# Altium project CAN_Analyzer.PrjPcb
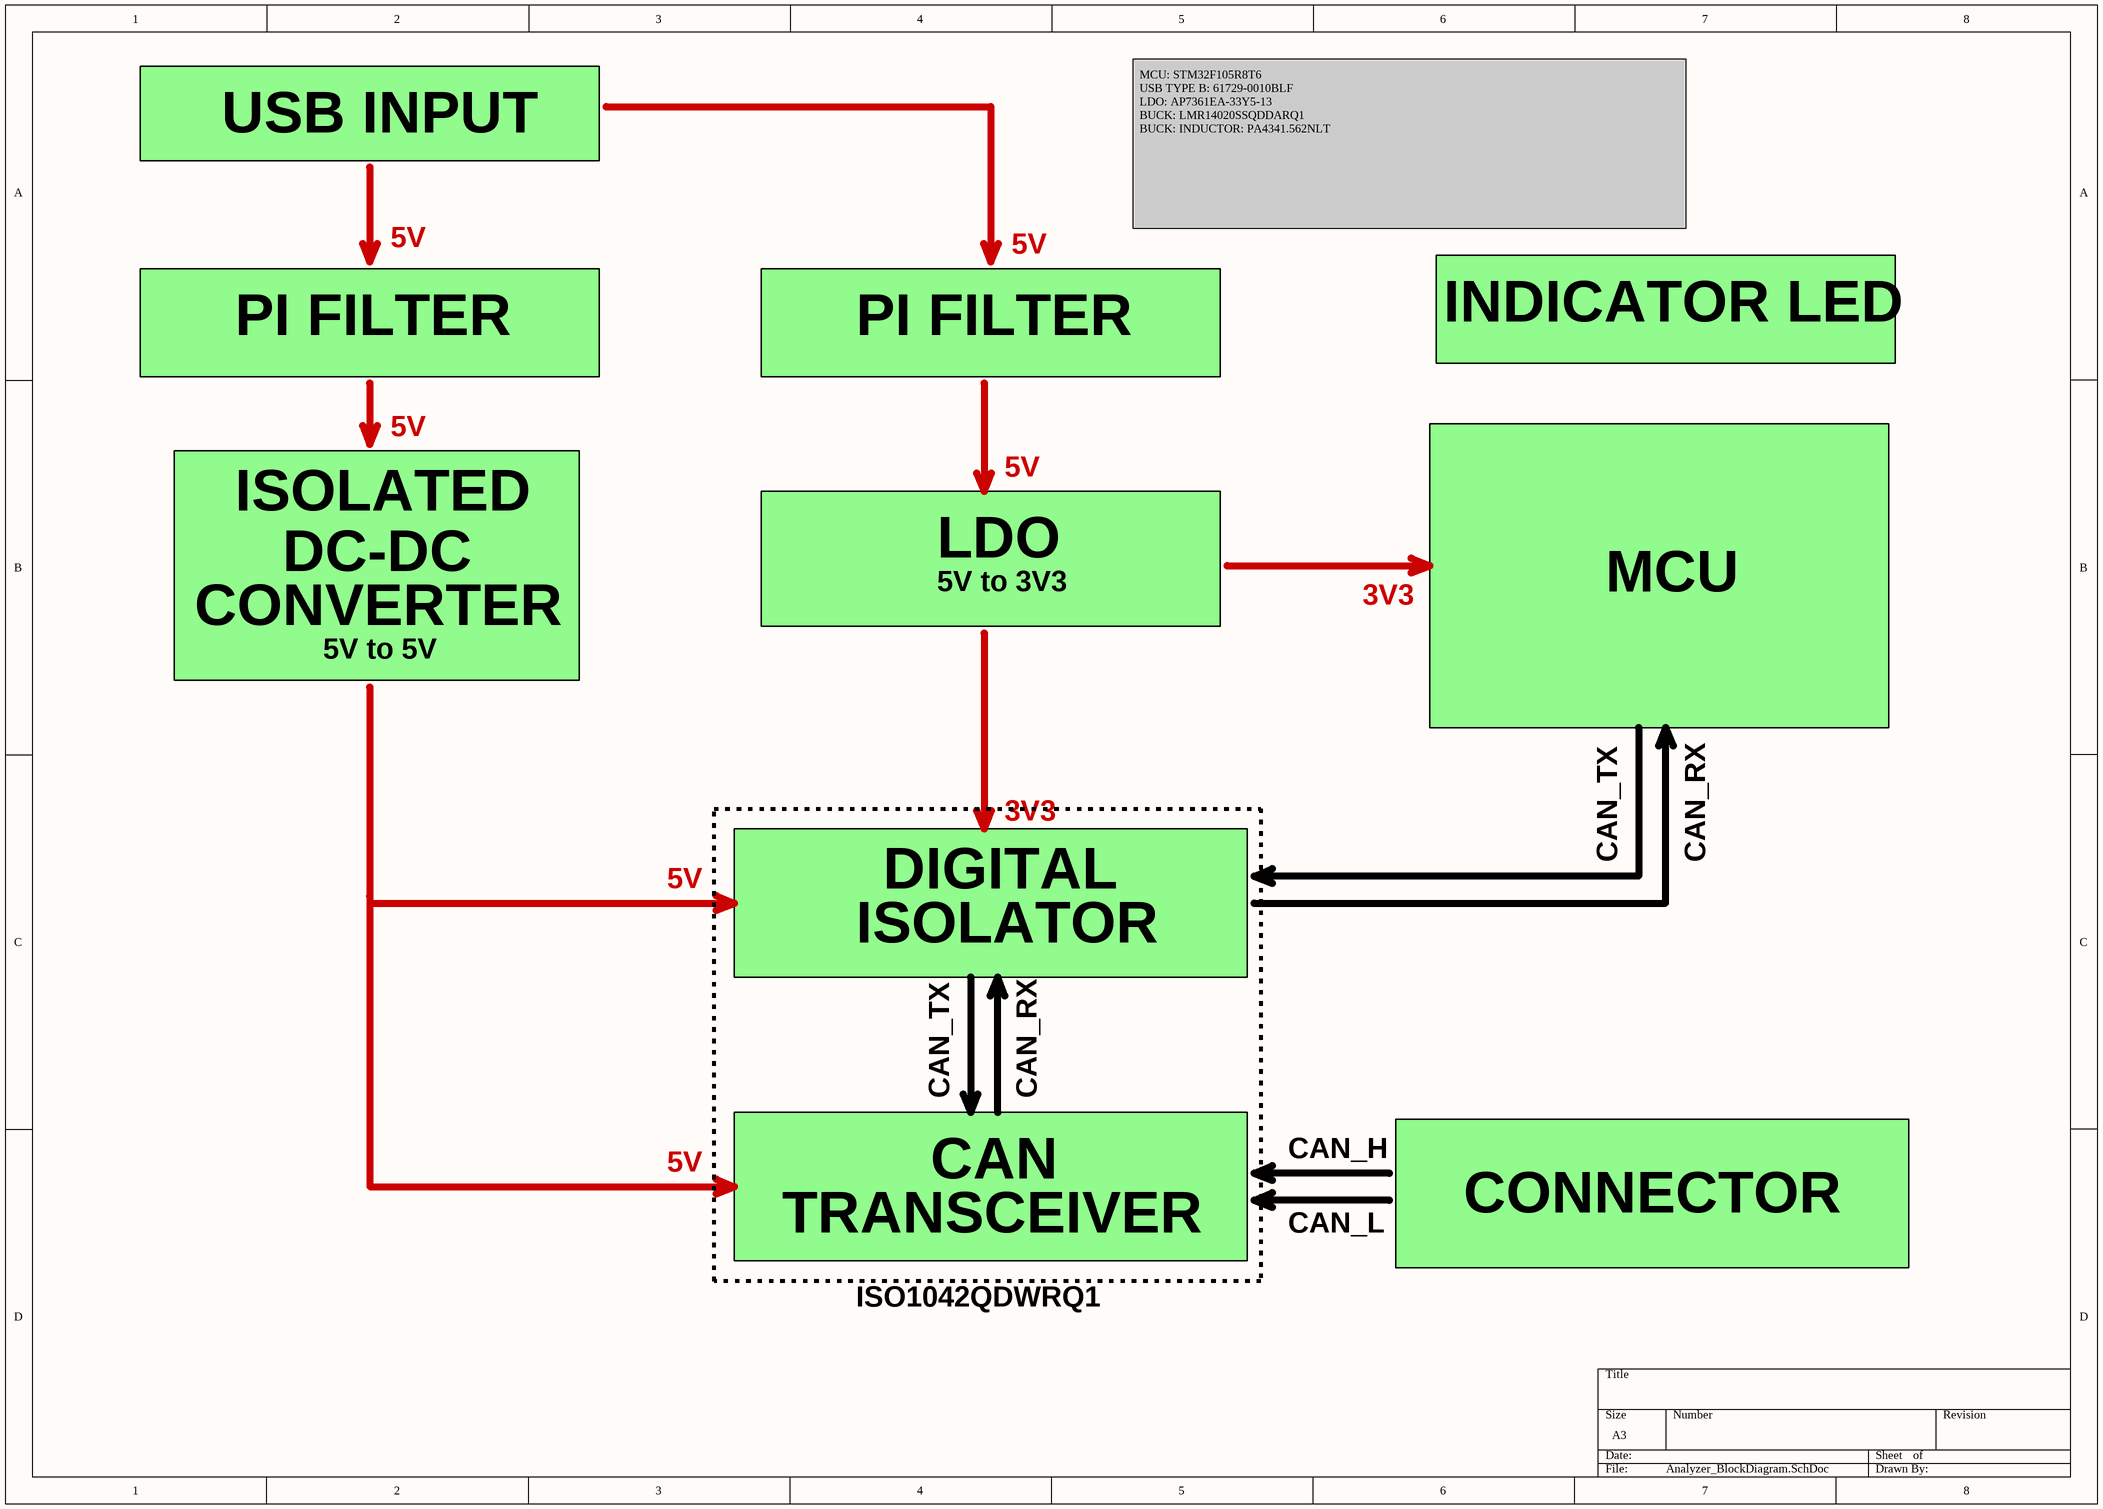
[diagram p0: Analyzer_BlockDiagram.SchDoc]
3 sheets, 78 parts. Net scope: global (net labels, ports and power ports of the same name join across sheets).
Sheets:
  Analyzer_BlockDiagram.SchDoc
  Analyzer_MCUSchematic.SchDoc
  Analyzer_PowerSchematic.SchDoc

## Sheet Analyzer_BlockDiagram.SchDoc
size A3; SheetNumber: 1; SheetTotal: 2

### Notes on the sheet
- USB INPUT
- MCU: STM32F105R8T6
  USB TYPE B: 61729-0010BLF
  LDO: AP7361EA-33Y5-13
  BUCK: LMR14020SSQDDARQ1
  BUCK: INDUCTOR: PA4341.562NLT
- 5V
- PI FILTER
- INDICATOR LED
- ISOLATED
- DC-DC
- LDO
- CONVERTER
- 5V to 3V3
- 3V3
- MCU
- 5V to 5V
- CAN_TX
- CAN_RX
- DIGITAL
- ISOLATOR
- CAN
- CAN_H
- TRANSCEIVER
- CAN_L
- CONNECTOR
- ISO1042QDWRQ1

## Sheet Analyzer_MCUSchematic.SchDoc
size A3; SheetNumber: 2; SheetTotal: 3
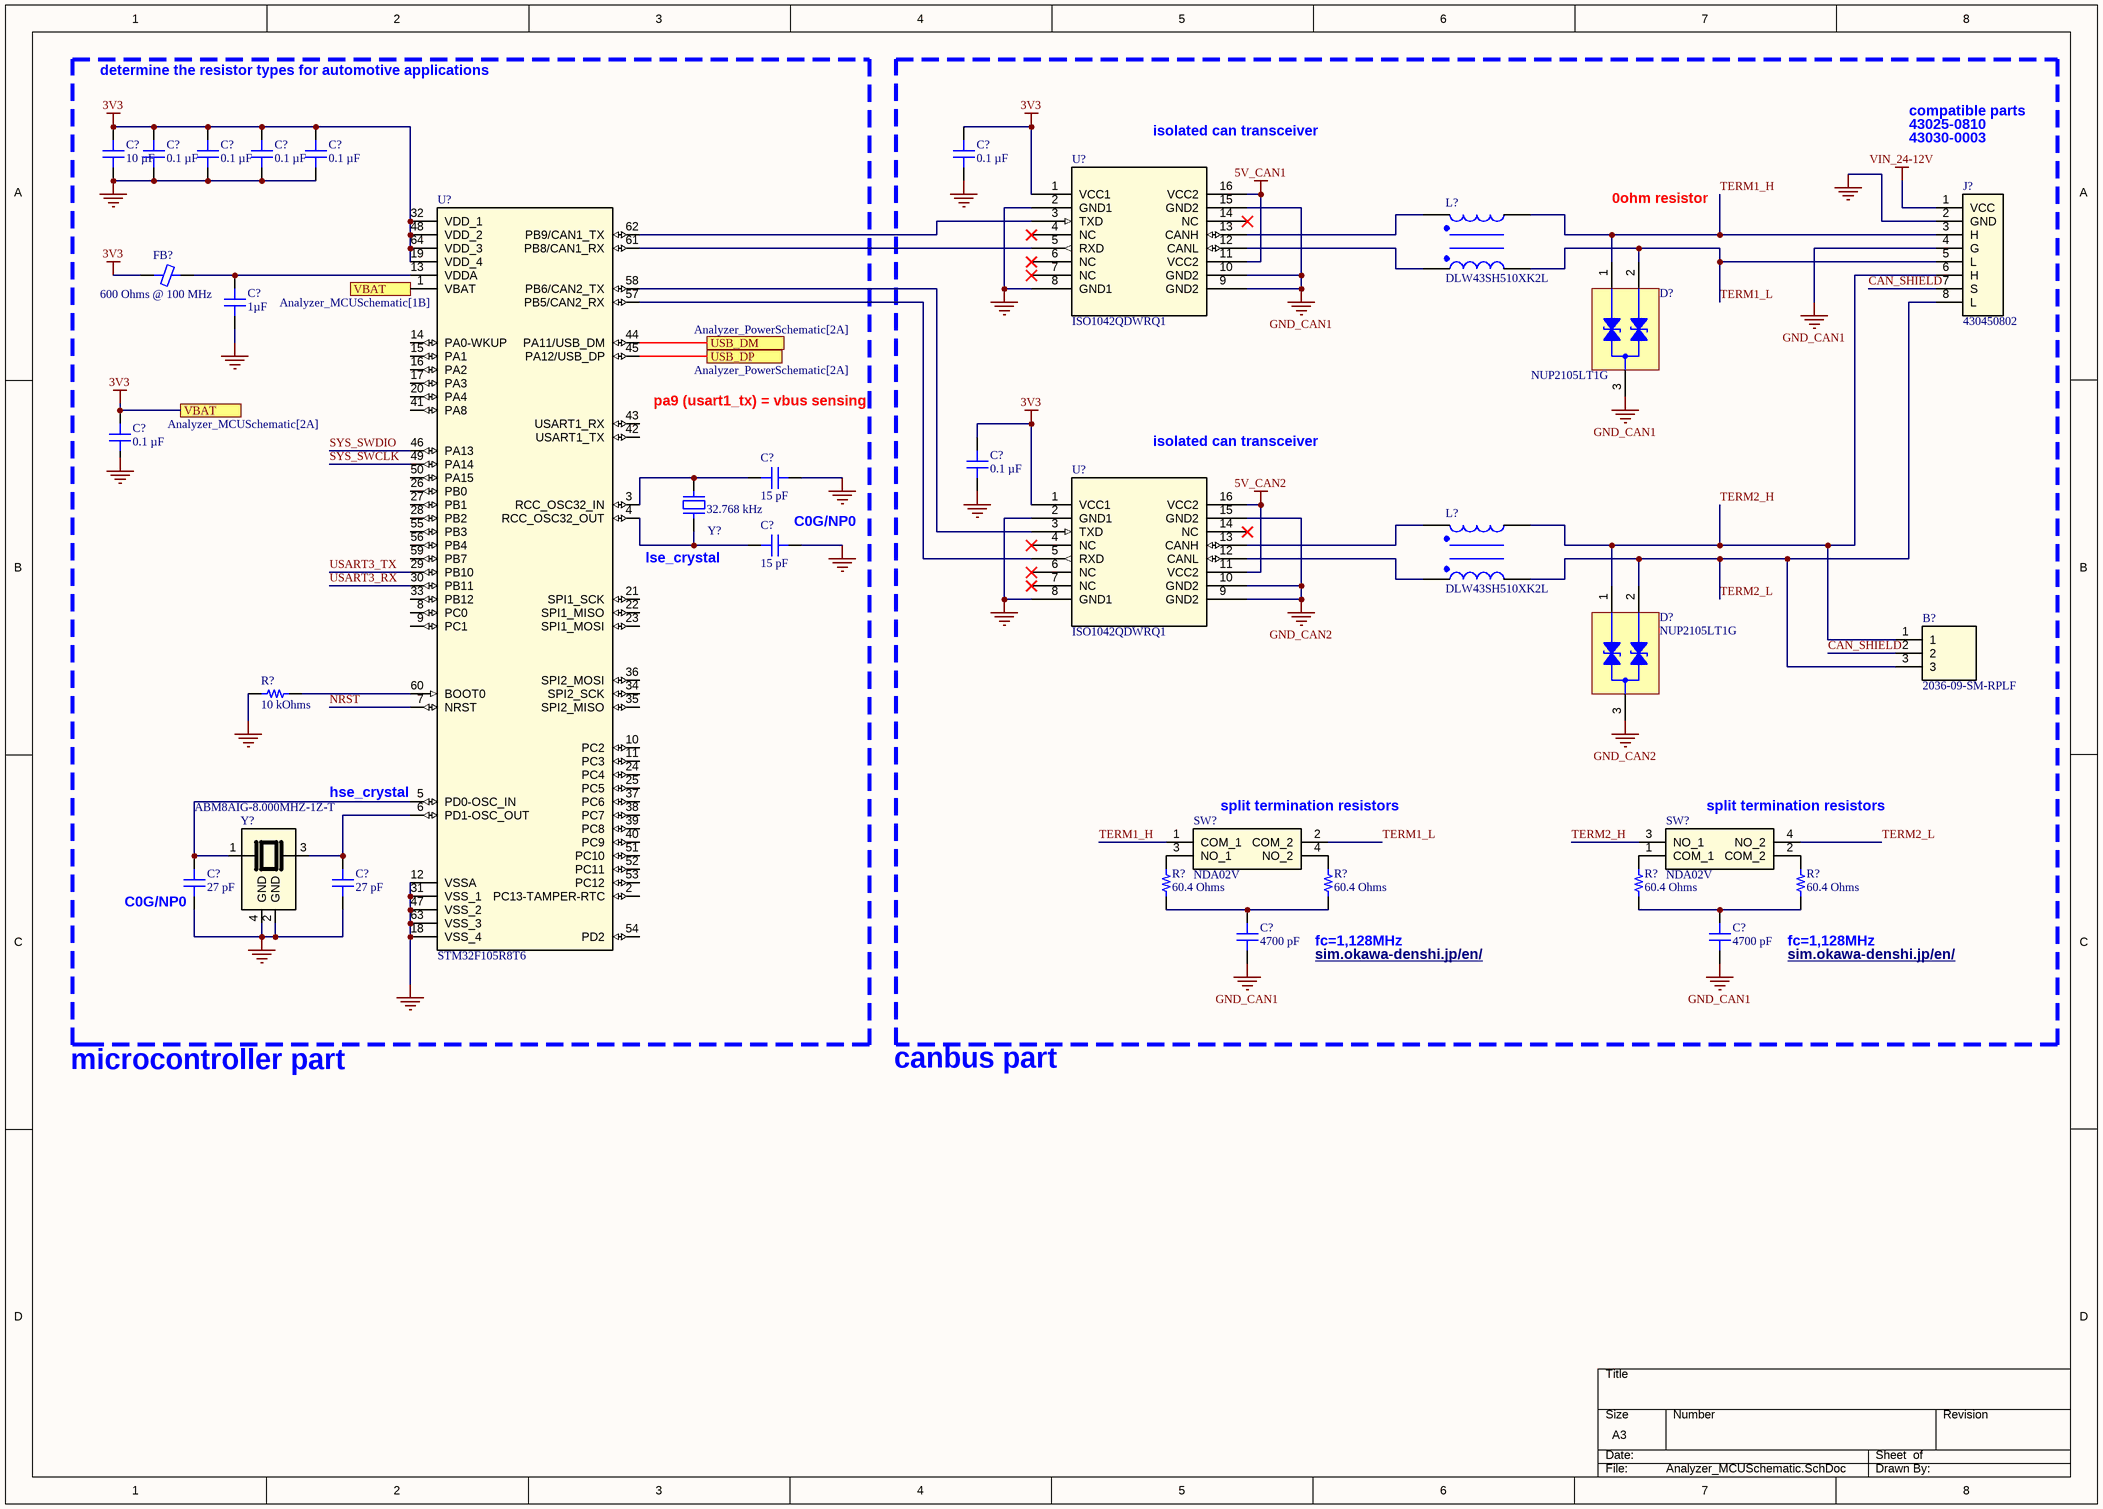
[diagram p1: Analyzer_MCUSchematic.SchDoc]

### Parts
(Parts that share a designator on the sheet are numbered #1, #2 ... from top to bottom, then left to right.)
B?  2036-09-SM-RPLF  [203609SMRPLF]
C?#1  10 µF  [CAP 0805_2012]
C?#2  0.1 µF  [CAP 0603_1608]
C?#3  0.1 µF  [CAP 0603_1608]
C?#4  0.1 µF  [CAP 0603_1608]
C?#5  0.1 µF  [CAP 0603_1608]
C?#6  0.1 µF  [CAP 0603_1608]
C?#7  1µF  [CAP 0603_1608]
C?#8  0.1 µF  [CAP 0603_1608]
C?#9  0.1 µF  [CAP 0603_1608]
C?#10  15 pF  [CAP 0603_1608]
C?#11  15 pF  [CAP 0603_1608]
C?#12  27 pF  [CAP 0603_1608]
C?#13  27 pF  [CAP 0603_1608]
C?#14  4700 pF  [CAP 0603_1608]
C?#15  4700 pF  [CAP 0603_1608]
D?#1  NUP2105LT1G  [ON SEMI SOT-23-3]
D?#2  NUP2105LT1G  [ON SEMI SOT-23-3]
FB?#1  600 Ohms @ 100 MHz  [FER 0603_1608]
J?#1  430450802  [CONN_SD-43045-001_08_MOL]
L?#1  DLW43SH510XK2L  [FIL_DLW43SH510XK2L]
L?#2  DLW43SH510XK2L  [FIL_DLW43SH510XK2L]
R?#1  10 kOhms  [RES 0603_1608]
R?#2  60.4 Ohms  [RES 0603_1608]
R?#3  60.4 Ohms  [RES 0603_1608]
R?#4  60.4 Ohms  [RES 0603_1608]
R?#5  60.4 Ohms  [RES 0603_1608]
SW?#1  NDA02V  [NDA02V]
SW?#2  NDA02V  [NDA02V]
U?#1  ISO1042QDWRQ1  [DW16_TEX]
U?#2  STM32F105R8T6  [QFP50P1200X1200X160-64N]
U?#3  ISO1042QDWRQ1  [DW16_TEX]
Y?#1  32.768 kHz  [ABRACON ABS06]
Y?#2  ABM8AIG-8.000MHZ-1Z-T  [XTAL_ABM8AIG-8.000MHZ-1Z-T]

### Ports
USB_DM (see Analyzer_PowerSchematic[2A]), USB_DP (see Analyzer_PowerSchematic[2A]), VBAT (see Analyzer_MCUSchematic[1B]), VBAT (see Analyzer_MCUSchematic[2A])

### Nets
3V3: C?#1.2 C?#2.2 C?#3.2 C?#4.2 C?#5.2 C?#6.2 C?#8.2 C?#9.2 FB?#1.1 U?#1.1(VCC1) U?#2.1(VBAT) U?#2.19(VDD_4) U?#2.32(VDD_1) U?#2.48(VDD_2) U?#2.64(VDD_3) U?#3.1(VCC1) ; port VBAT
5V_CAN1: U?#1.11(VCC2) U?#1.16(VCC2)
5V_CAN2: U?#3.11(VCC2) U?#3.16(VCC2)
GND: C?#1.1 C?#2.1 C?#3.1 C?#4.1 C?#5.1 C?#6.1 C?#7.1 C?#9.1 C?#10.2 C?#11.2 C?#12.1 C?#13.1 J?#1.2(GND) R?#1.1 U?#1.2(GND1) U?#1.8(GND1) U?#2.12(VSSA) U?#2.18(VSS_4) U?#2.31(VSS_1) U?#2.47(VSS_2) U?#2.63(VSS_3) U?#3.2(GND1) U?#3.8(GND1) Y?#2.2(GND) Y?#2.4(GND)
GND_CAN1: C?#14.1 C?#15.1 D?#1.3(I/O_2) J?#1.4(G) U?#1.9(GND2) U?#1.10(GND2) U?#1.15(GND2)
GND_CAN2: D?#2.3(I/O_2) U?#3.9(GND2) U?#3.10(GND2) U?#3.15(GND2)
VIN_24-12V: J?#1.1(VCC)
CAN_SHIELD: B?.2 J?#1.7(S)
NRST: U?#2.7(NRST)
SYS_SWCLK: U?#2.49(PA14)
SYS_SWDIO: U?#2.46(PA13)
TERM1_H: D?#1.1(I/O_1) J?#1.3(H) L?#1.2 SW?#2.1(COM_1)
TERM1_L: D?#1.2(GND) J?#1.5(L) L?#1.3 SW?#2.2(COM_2)
TERM2_H: B?.1 D?#2.1(I/O_1) J?#1.6(H) L?#2.2 SW?#1.3(NO_1)
TERM2_L: B?.3 D?#2.2(GND) J?#1.8(L) L?#2.3 SW?#1.4(NO_2)
USART3_RX: U?#2.30(PB11)
USART3_TX: U?#2.29(PB10)
NetC?#7_2: C?#7.2 FB?#1.2 U?#2.13(VDDA)
NetC?#10_1: C?#10.1 U?#2.3(RCC_OSC32_IN) Y?#1.1
NetC?#11_1: C?#11.1 U?#2.4(RCC_OSC32_OUT) Y?#1.2
NetC?#12_2: C?#12.2 Y?#2.1
NetC?#13_2: C?#13.2 Y?#2.3
NetC?#14_2: C?#14.2 R?#2.2 R?#3.2
NetC?#15_2: C?#15.2 R?#4.2 R?#5.2
NetL?#1_1: L?#1.1 U?#1.13(CANH)
NetL?#1_4: L?#1.4 U?#1.12(CANL)
NetL?#2_1: L?#2.1 U?#3.13(CANH)
NetL?#2_4: L?#2.4 U?#3.12(CANL)
NetR?#1_2: R?#1.2 U?#2.60(BOOT0)
NetR?#2_1: R?#2.1 SW?#2.3(NO_1)
NetR?#3_1: R?#3.1 SW?#2.4(NO_2)
NetR?#4_1: R?#4.1 SW?#1.1(COM_1)
NetR?#5_1: R?#5.1 SW?#1.2(COM_2)
NetU?#1_3: U?#1.3(TXD) U?#2.62(PB9/CAN1_TX)
NetU?#1_5: U?#1.5(RXD) U?#2.61(PB8/CAN1_RX)
NetU?#2_44: U?#2.44(PA11/USB_DM) ; port USB_DM
NetU?#2_45: U?#2.45(PA12/USB_DP) ; port USB_DP
NetU?#2_57: U?#2.57(PB5/CAN2_RX) U?#3.5(RXD)
NetU?#2_58: U?#2.58(PB6/CAN2_TX) U?#3.3(TXD)

Not connected (* = marked no-connect by the designer): C?#8 1; U?#1 4(NC)* 6(NC)* 7(NC)* 14(NC)*; U?#2 2(PC13-TAMPER-RTC) 5(PD0-OSC_IN) 6(PD1-OSC_OUT) 8(PC0) 9(PC1) 10(PC2) 11(PC3) 14(PA0-WKUP) 15(PA1) 16(PA2) 17(PA3) 20(PA4) 21(SPI1_SCK) 22(SPI1_MISO) 23(SPI1_MOSI) 24(PC4) 25(PC5) 26(PB0) 27(PB1) 28(PB2) 33(PB12) 34(SPI2_SCK) 35(SPI2_MISO) 36(SPI2_MOSI) 37(PC6) 38(PC7) 39(PC8) 40(PC9) 41(PA8) 42(USART1_TX) 43(USART1_RX) 50(PA15) 51(PC10) 52(PC11) 53(PC12) 54(PD2) 55(PB3) 56(PB4) 59(PB7); U?#3 4(NC)* 6(NC)* 7(NC)* 14(NC)*

### Notes on the sheet
- determine the resistor types for automotive applications
- isolated can transceiver
- compatible parts
- 43025-0810
- 43030-0003
- 0ohm resistor
- (near U?#2) pa9 (usart1_tx) = vbus sensing
- lse_crystal
- (near C?#11) C0G/NP0
- (near U?#2) hse_crystal
- (near SW?#2) split termination resistors
- (near SW?#1) split termination resistors
- (near C?#12) C0G/NP0
- (near R?#3) fc=1,128MHz
- sim.okawa-denshi.jp/en/ <http://sim.okawa-denshi.jp/en/>
- (near R?#5) fc=1,128MHz
- microcontroller part
- canbus part
- Labels drawn without touching a wire or pin: GND

### Library data of the parts
B? = 2036-09-SM-RPLF: SURGE ARRESTOR GDT 90V SMT Bourns 2036 Series 90V 10 kA@ 10 Operation, 20 kA@ 1 Operation SMD 3 Electrode Gas Discharge Tube; Geometry.Height: 5.2mm; Manufacturer_Name: Bourns; Manufacturer_Part_Number: 2036-09-SM-RPLF; Mouser Part Number: 652-2036-09-SM-RPLF; Mouser Price/Stock: https://www.mouser.co.uk/ProductDetail/Bourns/2036-09-SM-RPLF?qs=lCOfWMjvbt%252BBO3tBZtiSUQ%3D%3D; Arrow Part Number: 2036-09-SM-RPLF; Arrow Price/Stock: https://www.arrow.com/en/products/2036-09-sm-rplf/bourns?utm_currency=USD&region=nac; Datasheet Link: https://www.bourns.com/PDFs/2036-xx-SM.pdf
C?#1 = C2012X7R1A106K125AE: CAP CER 10UF 10V X7R 0805; manufacturer: TDK Corporation; Tolerance: ±10%; Part Number: C2012X7R1A106K125AE; Capacitance: 10 µF; Applications: Boardflex Sensitive; componentlink1description: Datasheet; componentlink1url: https://product.tdk.com/info/en/catalog/datasheets/mlcc_commercial_soft_en.pdf?ref_disty=digikey; componentlink2description: DigiKey Link; componentlink2url: https://www.digikey.com/en/products/detail/tdk-corporation/C2012X7R1A106K125AE/5809181; Device Package: 0805 (2012 Metric); Features: Soft Termination; lastupdated: 6.04.2026 19:33:17; Lifecycle Status: Active; Minimum Order: 1; Mounting Type: Surface Mount, MLCC; Operating Temperature: -55°C ~ 125°C; Package / Case: 0805 (2012 Metric); packaging: TapeAndReel; partid: 3036; Part Status: Active; price: 0.08; series: C; Size / Dimension: 0.079" L x 0.049" W (2.00mm x 1.25mm); Supplier 1: DigiKey; Supplier Part Number 1: 445-173616-1-ND; Temperature Coefficient: X7R; Thickness (Max): 0.059" (1.50mm); value: 10 µF; Voltage - Rated: 10V
C?#2-C?#6 C?#8 C?#9 = 0603B104J160CT: CAP CER 0.1UF 16V X7R 0603; manufacturer: Walsin Technology Corporation; Tolerance: ±5%; Part Number: 0603B104J160CT; Capacitance: 0.1 µF; Applications: General Purpose; componentlink1description: Datasheet; componentlink1url: http://www.passivecomponent.com/wp-content/uploads/2018/10/MLCC.pdf; componentlink2description: DigiKey Link; componentlink2url: https://www.digikey.com/en/products/detail/walsin-technology-corporation/0603B104J160CT/9354886; Device Package: 0603 (1608 Metric); lastupdated: 6.04.2026 19:23:13; Lifecycle Status: Active; Minimum Order: 1; Mounting Type: Surface Mount, MLCC; Operating Temperature: -55°C ~ 125°C; Package / Case: 0603 (1608 Metric); packaging: TapeAndReel; partid: 13150; Part Status: Active; price: 0.01; series: -; Size / Dimension: 0.063" L x 0.031" W (1.60mm x 0.80mm); Supplier 1: DigiKey; Supplier Part Number 1: 1292-1389-1-ND; Temperature Coefficient: X7R; Thickness (Max): 0.034" (0.87mm); value: 0.1 µF; Voltage - Rated: 16V
C?#7 = 0603YC105KAT2A: CAP CER 1UF 16V X7R 0603; manufacturer: AVX Corporation; Tolerance: ±10%; Part Number: 0603YC105KAT2A; Capacitance: 1µF; Applications: General Purpose; componentlink1description: Datasheet; componentlink1url: http://datasheets.avx.com/X7RDielectric.pdf; componentlink2description: DigiKey Link; componentlink2url: http://digikey.com/product-detail/en/avx-corporation/0603YC105KAT2A/478-5010-1-ND/1888221; Device Package: 0603 (1608 Metric); lastupdated: 2.09.2020 01:03:14; Lifecycle Status: Active; Minimum Order: 1; Mounting Type: Surface Mount, MLCC; Operating Temperature: -55°C ~ 125°C; Package / Case: 0603 (1608 Metric); packaging: TapeAndReel; partid: 14128; Part Status: Active; price: 0.04; series: -; Size / Dimension: 0.063" L x 0.032" W (1.60mm x 0.81mm); Supplier 1: DigiKey; Supplier Part Number 1: 478-5010-1-ND; Temperature Coefficient: X7R; Thickness (Max): 0.035" (0.90mm); value: 1µF; Voltage - Rated: 16V
C?#10 C?#11 = C0603C150J5GACAUTO: CAP CER 15PF 50V C0G/NP0 0603; manufacturer: KEMET; Temperature Coefficient: C0G, NP0; Tolerance: ±5%; Part Number: C0603C150J5GACAUTO; Capacitance: 15 pF; Applications: Automotive; componentlink1description: Datasheet; componentlink1url: https://api.kemet.com/component-edge/download/datasheet/C0603C150J5GACAUTO.pdf; componentlink2description: DigiKey Link; componentlink2url: https://www.digikey.com/en/products/detail/kemet/C0603C150J5GACAUTO/3314856; Device Package: 0603 (1608 Metric); Features: Low ESL; lastupdated: 6.04.2026 19:23:31; Lifecycle Status: Active; Minimum Order: 1; Mounting Type: Surface Mount, MLCC; Operating Temperature: -55°C ~ 125°C; Package / Case: 0603 (1608 Metric); packaging: TapeAndReel; partid: 7972; Part Status: Active; price: 0.01; Ratings: AEC-Q200; series: SMD Auto C0G; Size / Dimension: 0.063" L x 0.031" W (1.60mm x 0.80mm); Supplier 1: DigiKey; Supplier Part Number 1: 399-6859-1-ND; Thickness (Max): 0.034" (0.87mm); value: 15 pF; Voltage - Rated: 50V
C?#12 C?#13 = C0603C270J5GACAUTO: CAP CER 27PF 50V C0G/NP0 0603; manufacturer: KEMET; Temperature Coefficient: C0G, NP0; Tolerance: ±5%; Part Number: C0603C270J5GACAUTO; Capacitance: 27 pF; Applications: Automotive; componentlink1description: Datasheet; componentlink1url: https://api.kemet.com/component-edge/download/datasheet/C0603C270J5GACAUTO.pdf; componentlink2description: DigiKey Link; componentlink2url: https://www.digikey.com/en/products/detail/kemet/C0603C270J5GACAUTO/7516234; Device Package: 0603 (1608 Metric); Features: Low ESL; lastupdated: 6.04.2026 19:23:16; Lifecycle Status: Active; Minimum Order: 1; Mounting Type: Surface Mount, MLCC; Operating Temperature: -55°C ~ 125°C; Package / Case: 0603 (1608 Metric); packaging: TapeAndReel; partid: 12459; Part Status: Active; price: 0.01; Ratings: AEC-Q200; series: SMD Auto C0G; Size / Dimension: 0.063" L x 0.031" W (1.60mm x 0.80mm); Supplier 1: DigiKey; Supplier Part Number 1: 399-16001-1-ND; Thickness (Max): 0.034" (0.87mm); value: 27 pF; Voltage - Rated: 50V
C?#14 C?#15 = C1608NP01H472J080AA: CAP CER 4700PF 50V NP0 0603; manufacturer: TDK Corporation; Temperature Coefficient: C0G, NP0; Tolerance: ±5%; Part Number: C1608NP01H472J080AA; Capacitance: 4700 pF; Applications: General Purpose; componentlink1description: Datasheet; componentlink1url: https://product.tdk.com/info/en/catalog/datasheets/mlcc_commercial_hightemp_en.pdf?ref_disty=digikey; componentlink2description: DigiKey Link; componentlink2url: https://www.digikey.com/en/products/detail/tdk-corporation/C1608NP01H472J080AA/3951319; Device Package: 0603 (1608 Metric); Features: High Temperature; lastupdated: 6.04.2026 19:23:27; Lifecycle Status: Active; Minimum Order: 1; Mounting Type: Surface Mount, MLCC; Operating Temperature: -55°C ~ 150°C; Package / Case: 0603 (1608 Metric); packaging: TapeAndReel; partid: 9062; Part Status: Active; price: 0.04; series: C; Size / Dimension: 0.063" L x 0.031" W (1.60mm x 0.80mm); Supplier 1: DigiKey; Supplier Part Number 1: 445-14083-1-ND; Thickness (Max): 0.035" (0.90mm); value: 4700 pF; Voltage - Rated: 50V
D?#1 D?#2 = NUP2105LT1G: TVS DIODE 24V 44V SOT23-3; Manufacturer: ON Semiconductor; Bidirectional Channels: 2; Capacitance @ Frequency: 30pF @ 1MHz; Current - Peak Pulse (10/1000µs): 8A (8/20µs); Power Line Protection: No; Power - Peak Pulse: 350W; Type: Zener; Voltage - Breakdown (Min): 26.2V; Voltage - Reverse Standoff (Typ): 24V (Min); Part Number: NUP2105LT1G; Applications: General Purpose; ComponentLink1Description: Datasheet; ComponentLink1URL: http://www.onsemi.com/pub/Collateral/NUP2105L-D.PDF; ComponentLink2Description: DigiKey Link; ComponentLink2URL: http://digikey.com/product-detail/en/on-semiconductor/NUP2105LT1G/NUP2105LT1GOSCT-ND/1485001; Device Package: TO-236-3, SC-59, SOT-23-3; LastUpdated: 30.03.2020 16:33:57; Lifecycle Status: Active; Minimum Order: 1; Mounting Type: Surface Mount; Operating Temperature: -55°C ~ 150°C (TJ); Package / Case: TO-236-3, SC-59, SOT-23-3; Packaging: TapeAndReel; PartId: 10506; Part Status: Active; Price: 0.09; Series: -; Supplier 1: DigiKey; Supplier Part Number 1: NUP2105LT1GOSCT-ND; Supplier Device Package: SOT-23-3 (TO-236); Voltage - Clamping (Max) @ Ipp: 44V
FB?#1 = GZ1608D601TF: FERRITE BEAD 600 OHM 0603 1LN; Manufacturer: Shenzhen Sunlord Electronics Co., Ltd.; Current Rating (Max): 200mA; DC Resistance (DCR) (Max): 450mOhm; Filter Type: Signal Line; Number of Lines: 1; Part Number: GZ1608D601TF; ComponentLink1Description: Datasheet; ComponentLink1URL: https://www.sunlordinc.com/Download.aspx?file=L1VwbG9hZEZpbGVzL1BERl9DYXQvMjAxOTA0MDgxMzU0MTk3NjMucGRm&lan=en; ComponentLink2Description: DigiKey Link; ComponentLink2URL: https://www.digikey.com/en/products/detail/shenzhen-sunlord-electronics-co-ltd/GZ1608D601TF/14120345; Device Package: 0603 (1608 Metric); Height (Max): 0.037" (0.95mm); Impedance @ Frequency: 600 Ohms @ 100 MHz; LastUpdated: 5.04.2026 20:28:01; Lifecycle Status: Active; Minimum Order: 1; Mounting Type: Surface Mount; Operating Temperature: -55°C ~ 125°C; Package / Case: 0603 (1608 Metric); Packaging: TapeAndReel; PartId: 2637; Part Status: Active; Price: 0.01; Series: GZ; Size / Dimension: 0.063" L x 0.031" W (1.60mm x 0.80mm); Supplier 1: DigiKey; Supplier Part Number 1: 3442-GZ1608D601TFCT-ND; Value: 600 Ohms @ 100 MHz
J?#1 = 430450802: Micro-Fit 3.0 Right-Angle Header, 3.00mm Pitch, Dual Row, 8 Circuits, with Snap-in Plastic Peg PCB Lock, 0.76Âµm Gold Plating, Glow-Wire Capable, Black; Manufacturer_Name: Molex; Copyright: Copyright (C) 2026 Ultra Librarian. All rights reserved.; Manufacturer_Part_Number: 430450802; Datasheet: https://www.molex.com/en-us/products/part-detail-pdf/430450802?display=pdf; Digi-Key_Part_Number_1: WM1822-ND; RefDes: RefDes; Type: Type
L?#1 L?#2 = DLW43SH510XK2L: 51µH @ 1MHz 2 Line Common Mode Choke Surface Mount 230mA DCR 1Ohm; MF: Murata; Value: *; MP: DLW43SH510XK2L; SnapEDA_Link: https://www.snapeda.com/parts/DLW43SH510XK2L/Murata/view-part/4300308/?ref=snap; Availability: Unavailable; Price: None; Package: 1812 Murata
R?#1 = RT0603FRE0710KL: RES SMD 10K OHM 1% 1/10W 0603; Manufacturer: Yageo; Power (Watts): 0.1W, 1/10W; Temperature Coefficient: ±50ppm/°C; Part Number: RT0603FRE0710KL; Value: 10 kOhms; ComponentLink1Description: Datasheet; ComponentLink1URL: https://www.yageo.com/upload/media/product/productsearch/datasheet/rchip/PYu-RT_1-to-0.01_RoHS_L_11.pdf; ComponentLink2Description: DigiKey Link; ComponentLink2URL: https://www.digikey.com/en/products/detail/yageo/RT0603FRE0710KL/1075040; Composition: Thin Film; Device Package: 0603 (1608 Metric); Height - Seated (Max): 0.022" (0.55mm); LastUpdated: 6.04.2026 19:44:01; Lifecycle Status: Active; Minimum Order: 1; Number of Terminations: 2; Operating Temperature: -55°C ~ 155°C; Package / Case: 0603 (1608 Metric); Packaging: TapeAndReel; PartId: 5671; Part Status: Active; Price: 0.01; Resistance: 10 kOhms; Series: RT; Size / Dimension: 0.063" L x 0.031" W (1.60mm x 0.80mm); Supplier 1: DigiKey; Supplier Part Number 1: YAG2321CT-ND; Supplier Device Package: 0603; Tolerance: ±1%
R?#2-R?#5 = RC0603FR-0760R4L: RES 60.4 OHM 1% 1/10W 0603; Manufacturer: Yageo; Power (Watts): 0.1W, 1/10W; Temperature Coefficient: ±100ppm/°C; Part Number: RC0603FR-0760R4L; Value: 60.4 Ohms; ComponentLink1Description: Datasheet; ComponentLink1URL: https://www.yageo.com/upload/media/product/productsearch/datasheet/rchip/PYu-RC_Group_51_RoHS_L_10.pdf; ComponentLink2Description: DigiKey Link; ComponentLink2URL: https://www.digikey.com/en/products/detail/yageo/RC0603FR-0760R4L/727327; Composition: Thick Film; Device Package: 0603 (1608 Metric); Features: Moisture Resistant; Height - Seated (Max): 0.022" (0.55mm); LastUpdated: 6.04.2026 19:43:46; Lifecycle Status: Active; Minimum Order: 1; Number of Terminations: 2; Operating Temperature: -55°C ~ 155°C; Package / Case: 0603 (1608 Metric); Packaging: CutTape; PartId: 19096; Part Status: Active; Price: 0.01; Resistance: 60.4 Ohms; Series: RC_L; Size / Dimension: 0.063" L x 0.031" W (1.60mm x 0.80mm); Supplier 1: DigiKey; Supplier Part Number 1: 311-60.4HRCT-ND; Supplier Device Package: 0603; Tolerance: ±1%
SW?#1 SW?#2 = NDA02V: SWITCH DIL RA SPST 50MA 24V TH; Manufacturer_Name: Apem; Geometry.Height: 9.9mm; Manufacturer_Part_Number: NDA02V; Mouser Part Number: 642-NDA02V; Mouser Price/Stock: https://www.mouser.co.uk/ProductDetail/Apem/NDA02V?qs=W0yvOO0ixfEICVFeWba0EQ%3D%3D; Arrow Part Number: *; Arrow Price/Stock: *; Datasheet Link: https://www.apem.com/us/nda-series-174.html
U?#1 U?#3 = ISO1042QDWRQ1: Automotive, isolated CAN transceiver with 70-V bus fault protection & flexible data rate 16-SOIC -40 to 125; Manufacturer_Name: Texas Instruments; Copyright: Copyright (C) 2026 Ultra Librarian. All rights reserved.; Manufacturer_Part_Number: ISO1042QDWRQ1; Datasheet: https://www.ti.com/lit/gpn/iso1042-q1; Digi-Key_Part_Number_1: 296-52278-1-ND; Digi-Key_Part_Number_2: 296-52278-2-ND; Digi-Key_Part_Number_3: 296-52278-6-ND; RefDes: RefDes; Type: Type
U?#2 = STM32F105R8T6: Mainstream Connectivity line, ARM Cortex-M3 with 64 Kbytes Flash, 72 MHz CPU, CAN, USB 2.0 OTG; MF: {'manufacturer': u'STMicroelectronics'}; Package: None; Price: None; Value: *; MP: STM32F105R8T6; Availability: Unavailable
Y?#1 = ABS06-32.768KHZ-1-T: CRYSTAL 32.7680KHZ 12.5PF SMD; Manufacturer: Abracon LLC; ESR (Equivalent Series Resistance): 90 kOhms; Frequency Tolerance: ±10ppm; Operating Mode: Fundamental; Part Number: ABS06-32.768KHZ-1-T; ComponentLink1Description: Datasheet; ComponentLink1URL: https://abracon.com/Resonators/ABS06.pdf; ComponentLink2Description: DigiKey Link; ComponentLink2URL: https://www.digikey.com/en/products/detail/abracon-llc/ABS06-32-768KHZ-1-T/2217994; Frequency: 32.768 kHz; Height - Seated (Max): 0.024" (0.60mm); LastUpdated: 5.04.2026 20:41:05; Lifecycle Status: Active; Load Capacitance: 12.5pF; Minimum Order: 1; Mounting Type: Surface Mount; Operating Temperature: -40°C ~ 85°C; Package / Case: 2-SMD, No Lead; Packaging: TapeAndReel; PartId: 370; Part Status: Active; Price: 0.36; Series: ABS06; Size / Dimension: 0.079" L x 0.047" W (2.00mm x 1.20mm); Supplier 1: DigiKey; Supplier Part Number 1: 535-10248-1-ND; Type: kHz Crystal (Tuning Fork); Value: 32.768 kHz
Y?#2 = ABM8AIG-8.000MHZ-1Z-T: 8 MHz Â±10ppm Crystal 18pF 500 Ohms 4-SMD, No Lead; MF: Abracon LLC; SnapEDA_Link: https://www.snapeda.com/parts/ABM8AIG-8.000MHZ-1Z-T/Abracon/view-part/?ref=snap; Package: NON STANDARD Abracon; Value: *; MP: ABM8AIG-8.000MHZ-1Z-T; Check_prices: https://www.snapeda.com/parts/ABM8AIG-8.000MHZ-1Z-T/Abracon/view-part/?ref=eda

## Sheet Analyzer_PowerSchematic.SchDoc
size A3; SheetNumber: 3; SheetTotal: 3
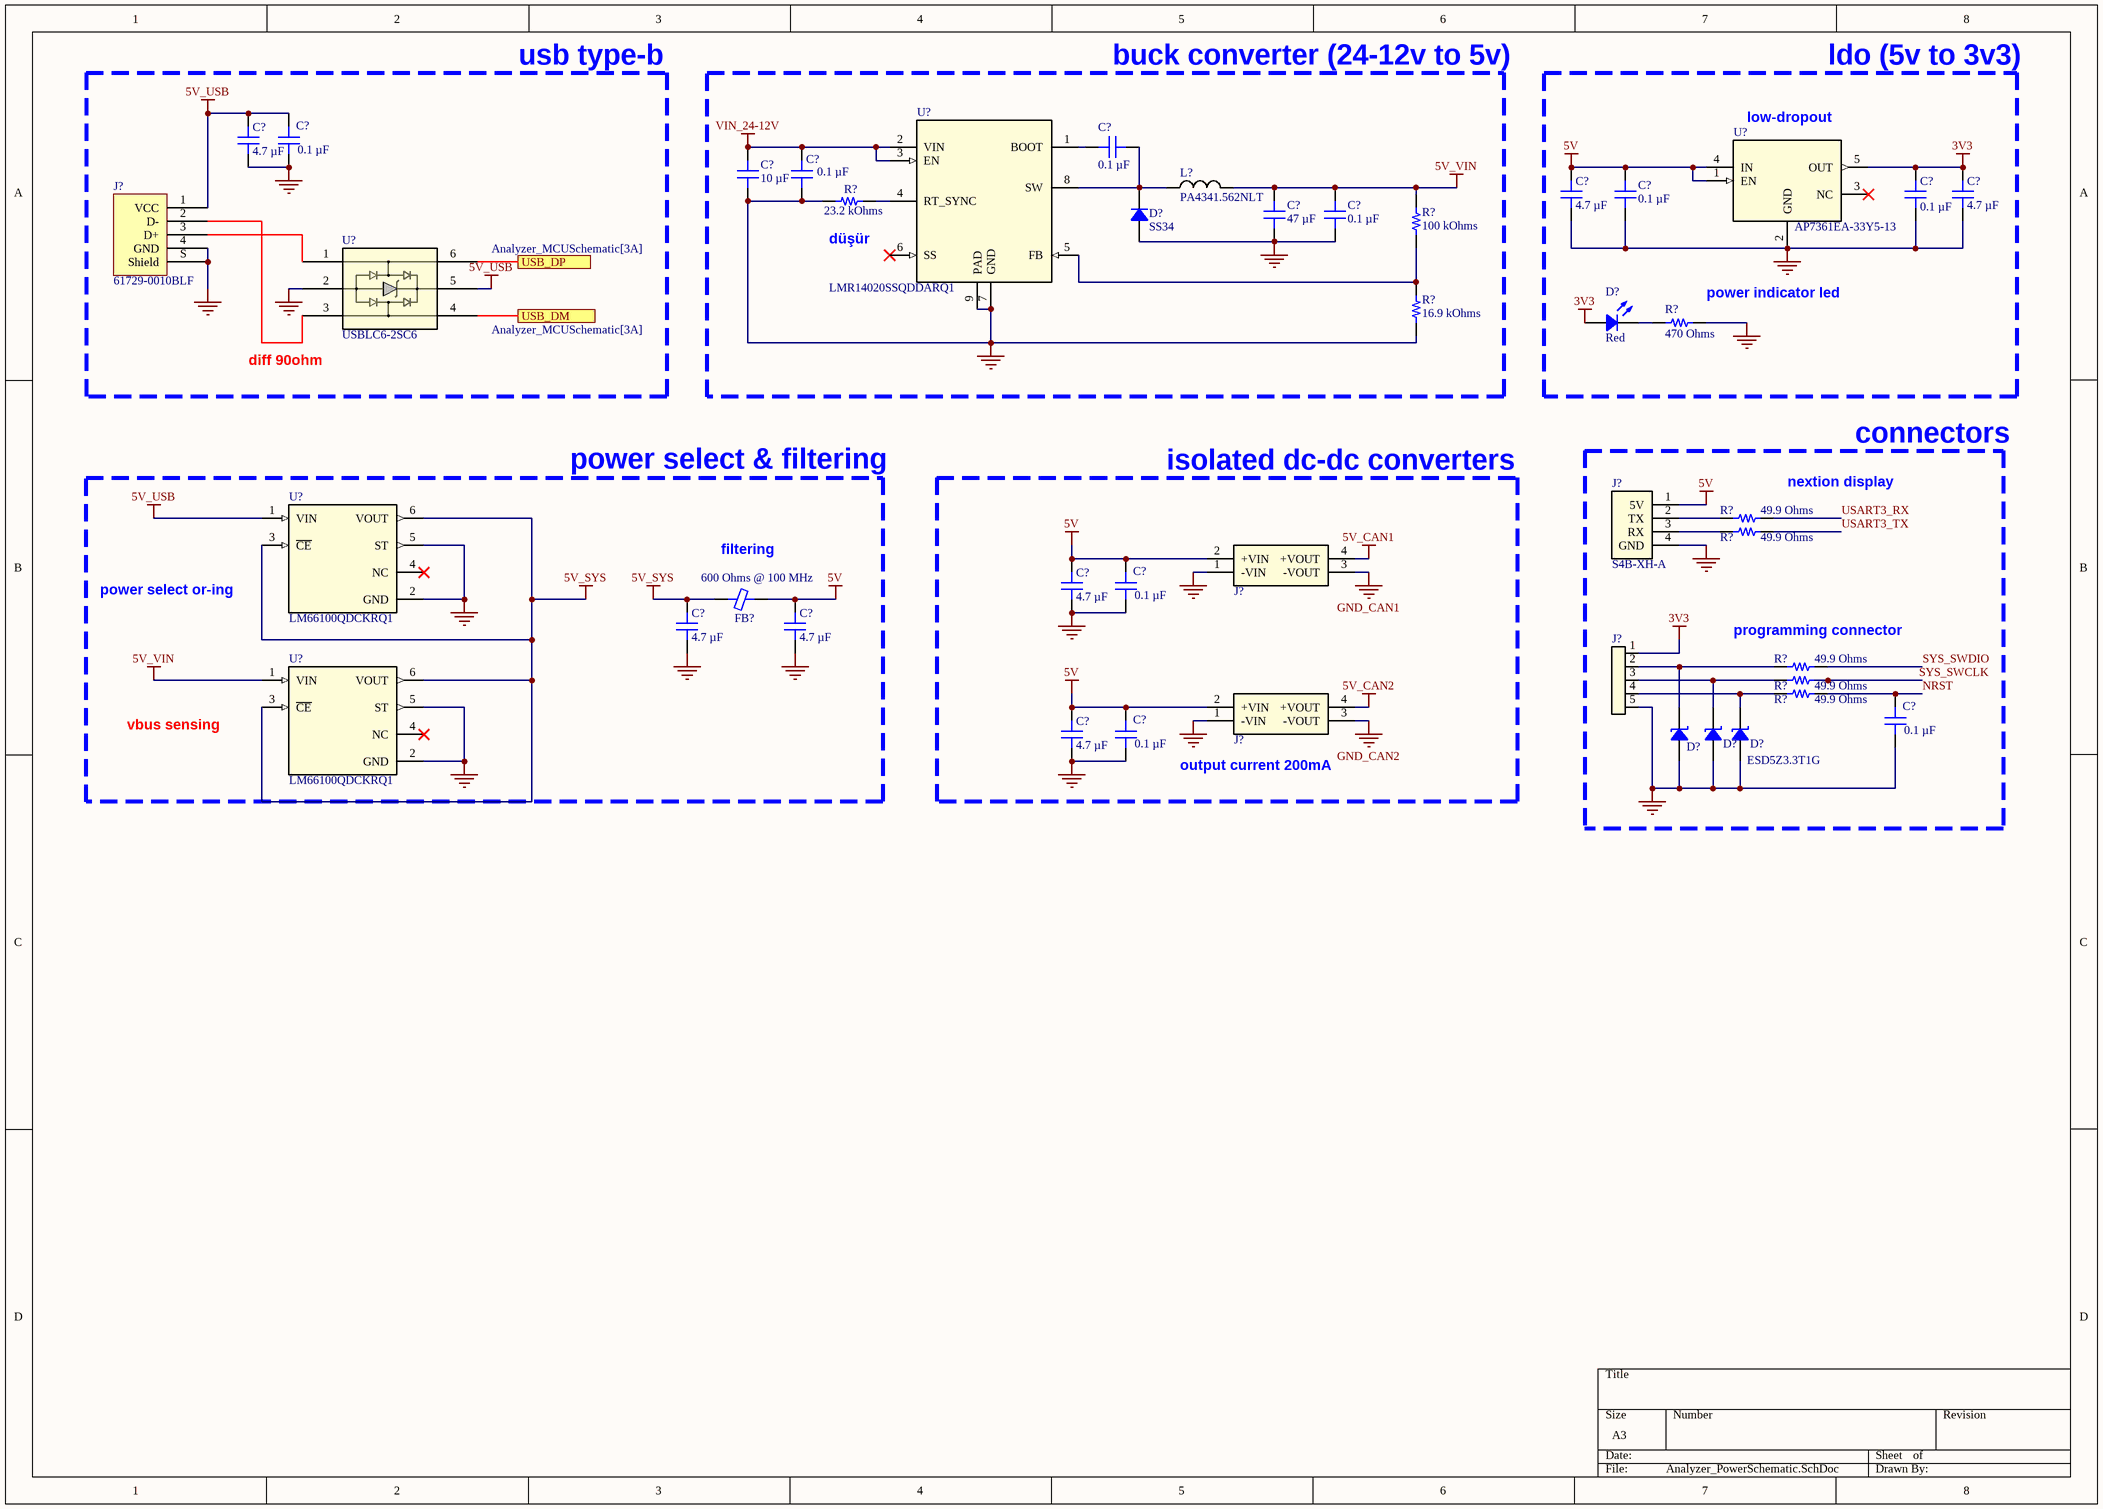
[diagram p2: Analyzer_PowerSchematic.SchDoc]

### Parts
(Parts that share a designator on the sheet are numbered #1, #2 ... from top to bottom, then left to right.)
C?#16  4.7 µF  [CAP 0603_1608]
C?#17  0.1 µF  [CAP 0603_1608]
C?#18  0.1 µF  [CAP 0603_1608]
C?#19  10 µF  [CAP 0805_2012]
C?#20  0.1 µF  [CAP 0603_1608]
C?#21  4.7 µF  [CAP 0603_1608]
C?#22  0.1 µF  [CAP 0603_1608]
C?#23  0.1 µF  [CAP 0603_1608]
C?#24  4.7 µF  [CAP 0603_1608]
C?#25  47 µF  [CAP 1206_3216 - 0.8MM]
C?#26  0.1 µF  [CAP 0603_1608]
C?#27  4.7 µF  [CAP 0603_1608]
C?#28  0.1 µF  [CAP 0603_1608]
C?#29  4.7 µF  [CAP 0603_1608]
C?#30  4.7 µF  [CAP 0603_1608]
C?#31  0.1 µF  [CAP 0603_1608]
C?#32  4.7 µF  [CAP 0603_1608]
C?#33  0.1 µF  [CAP 0603_1608]
D?#3  SS34  [DO214AB SMC]
D?#4  Red  [LED 0603_1608 RED]
D?#5  ESD5Z3.3T1G  [SOD523F]
D?#6  ESD5Z3.3T1G  [SOD523F]  (value not drawn)
D?#7  ESD5Z3.3T1G  [SOD523F]  (value not drawn)
FB?#2  600 Ohms @ 100 MHz  [FER 0603_1608]
J?#2  61729-0010BLF  [FCI USB 61729-0010BLF]
J?#3  S4B-XH-A  [JST_S4B-XH-A]
J?#4  CRE1S0505SC  [CRE1S0505SC]  (value not drawn)
J?#5  6130XX11121_61300511121  [61300511121]  (value not drawn)
J?#6  CRE1S0505SC  [CRE1S0505SC]  (value not drawn)
L?#3  PA4341.562NLT  [IND_222NLT_PUL]
R?#6  23.2 kOhms  [RES 0603_1608]
R?#7  100 kOhms  [RES 0603_1608]
R?#8  16.9 kOhms  [RES 0603_1608]
R?#9  470 Ohms  [RES 0603_1608]
R?#10  49.9 Ohms  [RES 0603_1608]
R?#11  49.9 Ohms  [RES 0603_1608]
R?#12  49.9 Ohms  [RES 0603_1608]
R?#13  49.9 Ohms  [RES 0603_1608]
R?#14  49.9 Ohms  [RES 0603_1608]
U?#4  AP7361EA-33Y5-13  [SOT89-5_DIO]
U?#5  LMR14020SSQDDARQ1  [DDA0008E_N]
U?#6  USBLC6-2SC6  [SOT95P280X145-6N]
U?#7  AUTOMOTIVE 1.5-V TO 5.5-V, 1.5-A  [SOT65P210X110-6N]  (value not drawn)
U?#8  AUTOMOTIVE 1.5-V TO 5.5-V, 1.5-A  [SOT65P210X110-6N]  (value not drawn)

### Blocks framed on the sheet
usb type-b: C?#16 C?#17 J?#2 U?#6
buck converter (24-12v to 5v): C?#18-C?#20 C?#25 C?#26 D?#3 L?#3 R?#6-R?#8 U?#5
ldo (5v to 3v3): C?#21-C?#24 D?#4 R?#9 U?#4
connectors: C?#31 D?#5-D?#7 J?#3 J?#5 R?#10-R?#14
power select & filtering: C?#29 C?#30 FB?#2 U?#7 U?#8
isolated dc-dc converters: C?#27 C?#28 C?#32 C?#33 J?#4 J?#6

### Ports
USB_DM (see Analyzer_MCUSchematic[3A]), USB_DP (see Analyzer_MCUSchematic[3A])

### Nets
3V3: C?#23.2 C?#24.2 D?#4.1 J?#5.1 U?#4.5(OUT)
5V: C?#21.2 C?#22.2 C?#27.2 C?#28.2 C?#30.2 C?#32.2 C?#33.2 FB?#2.2 J?#3.1(5V) J?#4.2(+VIN) J?#6.2(+VIN) U?#4.1(EN) U?#4.4(IN)
5V_CAN1: J?#4.4(+VOUT)
5V_CAN2: J?#6.4(+VOUT)
5V_SYS: C?#29.2 FB?#2.1 U?#7.3(~{CE}) U?#7.6(VOUT) U?#8.3(~{CE}) U?#8.6(VOUT)
5V_USB: C?#16.2 C?#17.2 J?#2.1(VCC) U?#6.5 U?#7.1(VIN)
5V_VIN: C?#25.2 C?#26.2 L?#3.1 R?#7.2 U?#8.1(VIN)
GND: C?#16.1 C?#17.1 C?#19.1 C?#20.1 C?#21.1 C?#22.1 C?#23.1 C?#24.1 C?#25.1 C?#26.1 C?#27.1 C?#28.1 C?#29.1 C?#30.1 C?#31.1 C?#32.1 C?#33.1 D?#3.1 D?#5.1 D?#6.1 D?#7.1 J?#2.4(GND) J?#2.S(Shield) J?#3.4(GND) J?#4.1(-VIN) J?#5.5 J?#6.1(-VIN) R?#6.2 R?#8.1 R?#9.2 U?#4.2(GND) U?#5.7(GND) U?#5.9(PAD) U?#6.2 U?#7.2(GND) U?#7.5(ST) U?#8.2(GND) U?#8.5(ST)
GND_CAN1: J?#4.3(-VOUT)
GND_CAN2: J?#6.3(-VOUT)
VIN_24-12V: C?#19.2 C?#20.2 U?#5.2(VIN) U?#5.3(EN)
NRST: C?#31.2 R?#14.2
SYS_SWCLK: R?#13.2
SYS_SWDIO: R?#12.2
USART3_RX: R?#10.2
USART3_TX: R?#11.2
NetC?#18_1: C?#18.1 D?#3.2 L?#3.2 U?#5.8(SW)
NetC?#18_2: C?#18.2 U?#5.1(BOOT)
NetD?#4_2: D?#4.2 R?#9.1
NetD?#5_2: D?#5.2 J?#5.2 R?#12.1
NetD?#6_2: D?#6.2 J?#5.3 R?#13.1
NetD?#7_2: D?#7.2 J?#5.4 R?#14.1
NetJ?#2_2: J?#2.2(D-) U?#6.3
NetJ?#2_3: J?#2.3(D+) U?#6.1
NetJ?#3_2: J?#3.2(TX) R?#10.1
NetJ?#3_3: J?#3.3(RX) R?#11.1
NetR?#6_1: R?#6.1 U?#5.4(RT_SYNC)
NetR?#7_1: R?#7.1 R?#8.2 U?#5.5(FB)
NetU?#2_44: U?#6.4 ; port USB_DM
NetU?#2_45: U?#6.6 ; port USB_DP

Not connected (* = marked no-connect by the designer): U?#4 3(NC)*; U?#5 6(SS)*; U?#7 4(NC)*; U?#8 4(NC)*

### Notes on the sheet
- (near U?#4) low-dropout
- (near R?#6) düşür
- (near R?#9) power indicator led
- (near U?#6) diff 90ohm
- (near R?#10) nextion display
- filtering
- (near U?#7) power select or-ing
- (near R?#12) programming connector
- vbus sensing
- output current 200mA

### Library data of the parts
C?#16 C?#21 C?#24 C?#27 C?#29 C?#30 C?#32 = 0603YW475KAT2A: CAP CER 4.7UF 16V X6S 0603; manufacturer: KYOCERA AVX; Tolerance: ±10%; Part Number: 0603YW475KAT2A; Capacitance: 4.7 µF; Applications: General Purpose; componentlink1description: Datasheet; componentlink1url: https://catalogs.kyocera-avx.com/SurfaceMount.pdf; componentlink2description: DigiKey Link; componentlink2url: https://www.digikey.com/en/products/detail/kyocera-avx/0603YW475KAT2A/14112130; Device Package: 0603 (1608 Metric); lastupdated: 6.04.2026 19:22:31; Lifecycle Status: Active; Minimum Order: 1; Mounting Type: Surface Mount, MLCC; Operating Temperature: -55°C ~ 105°C; Package / Case: 0603 (1608 Metric); packaging: TapeAndReel; partid: 35833; Part Status: Active; price: 0.07; series: -; Size / Dimension: 0.063" L x 0.031" W (1.60mm x 0.80mm); Supplier 1: DigiKey; Supplier Part Number 1: 478-0603YW475KAT2ACT-ND; Temperature Coefficient: X6S; Thickness (Max): 0.039" (1.00mm); value: 4.7 µF; Voltage - Rated: 16V
C?#17 C?#28 C?#31 C?#33 = CL10E104KC8VPNC: CAP CER 100NF 100V X8L 0603; manufacturer: Samsung Electro-Mechanics; Tolerance: ±10%; Part Number: CL10E104KC8VPNC; Capacitance: 0.1 µF; Applications: Automotive; componentlink1description: Datasheet; componentlink1url: https://mm.digikey.com/Volume0/opasdata/d220001/medias/docus/5458/CL10E104KC8VPNC_Spec.pdf; componentlink2description: DigiKey Link; componentlink2url: https://www.digikey.com/en/products/detail/samsung-electro-mechanics/CL10E104KC8VPNC/20498486; Device Package: 0603 (1608 Metric); Features: General Purpose; lastupdated: 6.04.2026 19:18:46; Lifecycle Status: Active; Minimum Order: 1; Mounting Type: Surface Mount, MLCC, Epoxy; Operating Temperature: -55°C ~ 150°C; Package / Case: 0603 (1608 Metric); packaging: TapeAndReel; partid: 68845; price: 0.04; Ratings: AEC-Q200; series: CL; Size / Dimension: 0.063" L x 0.031" W (1.60mm x 0.80mm); Supplier 1: DigiKey; Supplier Part Number 1: 1276-CL10E104KC8VPNCCT-ND; Temperature Coefficient: X8L; Thickness (Max): 0.035" (0.88mm); value: 0.1 µF; Voltage - Rated: 100V
C?#18 C?#20 C?#22 C?#23 C?#26 = 0603B104J160CT: as C?#2 on sheet Analyzer_MCUSchematic; Part Number: 0603B104J160CT; Capacitance: 0.1 µF; Applications: General Purpose; componentlink1description: Datasheet; componentlink1url: http://www.passivecomponent.com/wp-content/uploads/2018/10/MLCC.pdf; componentlink2description: DigiKey Link; componentlink2url: https://www.digikey.com/en/products/detail/walsin-technology-corporation/0603B104J160CT/9354886; Device Package: 0603 (1608 Metric); lastupdated: 6.04.2026 19:23:13; Lifecycle Status: Active; Minimum Order: 1; Mounting Type: Surface Mount, MLCC; Operating Temperature: -55°C ~ 125°C; Package / Case: 0603 (1608 Metric); packaging: TapeAndReel; partid: 13150; Part Status: Active; price: 0.01; series: -; Size / Dimension: 0.063" L x 0.031" W (1.60mm x 0.80mm); Supplier 1: DigiKey; Supplier Part Number 1: 1292-1389-1-ND; Temperature Coefficient: X7R; Thickness (Max): 0.034" (0.87mm); value: 0.1 µF; Voltage - Rated: 16V
C?#19 = C2012X7R1A106K125AE: as C?#1 on sheet Analyzer_MCUSchematic; Part Number: C2012X7R1A106K125AE; Capacitance: 10 µF; Applications: Boardflex Sensitive; componentlink1description: Datasheet; componentlink1url: https://product.tdk.com/info/en/catalog/datasheets/mlcc_commercial_soft_en.pdf?ref_disty=digikey; componentlink2description: DigiKey Link; componentlink2url: https://www.digikey.com/en/products/detail/tdk-corporation/C2012X7R1A106K125AE/5809181; Device Package: 0805 (2012 Metric); Features: Soft Termination; lastupdated: 6.04.2026 19:33:17; Lifecycle Status: Active; Minimum Order: 1; Mounting Type: Surface Mount, MLCC; Operating Temperature: -55°C ~ 125°C; Package / Case: 0805 (2012 Metric); packaging: TapeAndReel; partid: 3036; Part Status: Active; price: 0.08; series: C; Size / Dimension: 0.079" L x 0.049" W (2.00mm x 1.25mm); Supplier 1: DigiKey; Supplier Part Number 1: 445-173616-1-ND; Temperature Coefficient: X7R; Thickness (Max): 0.059" (1.50mm); value: 10 µF; Voltage - Rated: 10V
C?#25 = C3216X5R1E476M160AC: CAP CER 47UF 25V X5R 1206; manufacturer: TDK Corporation; Tolerance: ±20%; Part Number: C3216X5R1E476M160AC; Capacitance: 47 µF; Applications: General Purpose; componentlink1description: Datasheet; componentlink1url: https://product.tdk.com/info/en/catalog/datasheets/mlcc_commercial_general_en.pdf?ref_disty=digikey; componentlink2description: DigiKey Link; componentlink2url: https://www.digikey.com/en/products/detail/tdk-corporation/C3216X5R1E476M160AC/2792260; Device Package: 1206 (3216 Metric); Features: Low ESL; lastupdated: 6.04.2026 19:37:32; Lifecycle Status: Active; Minimum Order: 1; Mounting Type: Surface Mount, MLCC; Operating Temperature: -55°C ~ 85°C; Package / Case: 1206 (3216 Metric); packaging: TapeAndReel; partid: 47432; Part Status: Active; price: 0.25; series: C; Size / Dimension: 0.126" L x 0.063" W (3.20mm x 1.60mm); Supplier 1: DigiKey; Supplier Part Number 1: 445-8047-1-ND; Temperature Coefficient: X5R; Thickness (Max): 0.071" (1.80mm); value: 47 µF; Voltage - Rated: 25V
D?#3 = SS34: DIODE SCHOTTKY 40V 3A SMC; Manufacturer: ON Semiconductor; Current - Reverse Leakage @ Vr: 500µA @ 40V; Speed: Fast Recovery =< 500ns, > 200mA (Io); Voltage - Forward (Vf) (Max) @ If: 500mV @ 3A; Part Number: SS34; ComponentLink1Description: Datasheet; ComponentLink1URL: https://www.onsemi.com/pub/Collateral/SS39-D.PDF; ComponentLink2Description: DigiKey Link; ComponentLink2URL: http://digikey.com/product-detail/en/on-semiconductor/SS34/SS34FSCT-ND/2094459; Current - Average Rectified (Io): 3A; Diode Type: Schottky; LastUpdated: 5.04.2026 20:31:17; Lifecycle Status: Active; Minimum Order: 1; Mounting Type: Surface Mount; Operating Temperature - Junction: -55°C ~ 150°C; Package / Case: DO-214AB, SMC; Packaging: TapeAndReel; PartId: 1654; Part Status: Active; Price: 0.16; Series: -; Supplier 1: DigiKey; Supplier Part Number 1: SS34FSCT-ND; Supplier Device Package: SMC (DO-214AB); Voltage - DC Reverse (Vr) (Max): 40V
D?#4 = 5973035507F: LED RED 0603 SMD; Manufacturer: Dialight; Configuration: Standard; Current - Test: 20mA; Lens Color: 0.68mm; Lens Size: 1.20mm x 0.80mm; Lens Style: Rectangle with Flat Top; Millicandela Rating: 112mcd; Voltage - Forward (Vf) (Typ): 2V; Wavelength - Dominant: 620nm; Part Number: 5973035507F; Color: Red; ComponentLink1Description: Datasheet; ComponentLink1URL: http://www.dialightsignalsandcomponents.com/Assets/Drawings/2D_Drawings_DrawingDetailedSpec/NewDrawings/18369A.pdf; ComponentLink2Description: DigiKey Link; ComponentLink2URL: https://www.digikey.com/en/products/detail/dialight/5973035507F/9385430; Device Package: 0603 (1608 Metric); Height (Max): 0.68mm; LastUpdated: 5.04.2026 20:38:00; Lifecycle Status: Active; Minimum Order: 1; Mounting Type: Surface Mount; Package / Case: 0603 (1608 Metric); Packaging: TapeAndReel; PartId: 379; Part Status: Active; Price: 0.09; Series: 597; Size / Dimension: 1.60mm L x 0.80mm W; Supplier 1: DigiKey; Supplier Part Number 1: 350-4375-1-ND; Supplier Device Package: 0603; Value: Red
D?#5-D?#7 = ESD5Z3.3T1G: TVS DIODE 3.3V 14.1V SOD523; Manufacturer: ON Semiconductor; Capacitance @ Frequency: 105pF @ 1MHz; Current - Peak Pulse (10/1000µs): 11.2A (8/20µs); Power Line Protection: No; Power - Peak Pulse: 158W; Type: Zener; Unidirectional Channels: 1; Voltage - Breakdown (Min): 5V; Voltage - Reverse Standoff (Typ): 3.3V (Max); Part Number: ESD5Z3.3T1G; Applications: General Purpose; ComponentLink1Description: Datasheet; ComponentLink1URL: https://www.onsemi.com/pub/Collateral/ESD5Z2.5T1-D.PDF; ComponentLink2Description: DigiKey Link; ComponentLink2URL: http://digikey.com/product-detail/en/on-semiconductor/ESD5Z3.3T1G/ESD5Z3.3T1GOSCT-ND/1967044; LastUpdated: 5.04.2026 21:01:13; Lifecycle Status: Active; Minimum Order: 1; Mounting Type: Surface Mount; Operating Temperature: -55°C ~ 150°C (TJ); Package / Case: SC-79, SOD-523; Packaging: TapeAndReel; PartId: 9754; Part Status: Active; Price: 0.04; Series: -; Supplier 1: DigiKey; Supplier Part Number 1: ESD5Z3.3T1GOSCT-ND; Supplier Device Package: SOD-523; Voltage - Clamping (Max) @ Ipp: 14.1V
FB?#2 = GZ1608D601TF: as FB?#1 on sheet Analyzer_MCUSchematic; Part Number: GZ1608D601TF; ComponentLink1Description: Datasheet; ComponentLink1URL: https://www.sunlordinc.com/Download.aspx?file=L1VwbG9hZEZpbGVzL1BERl9DYXQvMjAxOTA0MDgxMzU0MTk3NjMucGRm&lan=en; ComponentLink2Description: DigiKey Link; ComponentLink2URL: https://www.digikey.com/en/products/detail/shenzhen-sunlord-electronics-co-ltd/GZ1608D601TF/14120345; Device Package: 0603 (1608 Metric); Height (Max): 0.037" (0.95mm); Impedance @ Frequency: 600 Ohms @ 100 MHz; LastUpdated: 5.04.2026 20:28:01; Lifecycle Status: Active; Minimum Order: 1; Mounting Type: Surface Mount; Operating Temperature: -55°C ~ 125°C; Package / Case: 0603 (1608 Metric); Packaging: TapeAndReel; PartId: 2637; Part Status: Active; Price: 0.01; Series: GZ; Size / Dimension: 0.063" L x 0.031" W (1.60mm x 0.80mm); Supplier 1: DigiKey; Supplier Part Number 1: 3442-GZ1608D601TFCT-ND; Value: 600 Ohms @ 100 MHz
J?#2 = 61729-0010BLF: CONN RCPT USB2.0 TYPEB 4POS R/A; Manufacturer: Amphenol ICC (FCI); Connector Type: USB - B; Current Rating (Amps): 1A; Gender: Receptacle; Mating Cycles: 1500; Number of Contacts: 4; Number of Ports: 1; Shielding: Shielded; Part Number: 61729-0010BLF; ComponentLink1Description: Datasheet; ComponentLink1URL: http://www.amphenol-icc.com/media/wysiwyg/files/drawing/61729.pdf; ComponentLink2Description: DigiKey Link; ComponentLink2URL: //digikey.com/product-detail/en/amphenol-icc-fci/61729-0010BLF/609-1039-ND/1001353; Features: Board Lock; LastUpdated: 9.12.2019 20:53:17; Lifecycle Status: 0; Minimum Order: 1; Mounting Feature: Horizontal; Mounting Type: Through Hole, Right Angle; Operating Temperature: -55°C ~ 85°C; Packaging: Tube; Part Status: Active; Price: 0.99; Series: 61729; Specifications: USB 2.0; Supplier 1: DigiKey; Supplier Part Number 1: 609-1039-ND; Termination: Solder
J?#4 J?#6 = CRE1S0505SC: Module DC-DC 5VIN 1-OUT 5V 0.2A 1W 4-Pin SIP Module Tube; Manufacturer_Name: Murata Electronics; Geometry.Height: 10.25mm; Manufacturer_Part_Number: CRE1S0505SC; Mouser Part Number: 580-CRE1S0505SC; Mouser Price/Stock: https://www.mouser.co.uk/ProductDetail/Murata-Power-Solutions/CRE1S0505SC?qs=pFP7BvE1PmyBR9paOK5h%2FA%3D%3D; Arrow Part Number: CRE1S0505SC; Arrow Price/Stock: https://www.arrow.com/en/products/cre1s0505sc/murata-power-solutions?utm_currency=USD&region=nac; Datasheet Link: https://www.mouser.com/datasheet/2/281/kdc_cre1-951969.pdf; ComponentLink1Description: Datasheet; ComponentLink1URL: https://pim.murata.com/asset/pim4/isolatedDCDCconverter/KDC_CRE1_PDF_ISOLATEDDCDCCONVERTER?lastModifiedDatetime=20250707193457
J?#5 = 6130XX11121_61300511121: MF: {'manufacturer': u'W\xfcrth Elektronik'}; Package: None; Price: None; Value: *; MP: 61300511121; Availability: Unavailable
L?#3 = PA4341.562NLT: FIXED IND 5.6UH 5A 48 MOHM SMD; Manufacturer_Name: Pulse Electronics Corporation; Copyright: Copyright (C) 2026 Ultra Librarian. All rights reserved.; Manufacturer_Part_Number: PA4341.562NLT
R?#6 = RT0603BRD0723K2L: RES SMD 23.2KOHM 0.1% 1/10W 0603; Manufacturer: Yageo; Power (Watts): 0.1W, 1/10W; Temperature Coefficient: ±25ppm/°C; Part Number: RT0603BRD0723K2L; Value: 23.2 kOhms; ComponentLink1Description: Datasheet; ComponentLink1URL: https://www.yageo.com/upload/media/product/productsearch/datasheet/rchip/PYu-RT_1-to-0.01_RoHS_L_11.pdf; ComponentLink2Description: DigiKey Link; ComponentLink2URL: https://www.digikey.com/en/products/detail/yageo/RT0603BRD0723K2L/1072377; Composition: Thin Film; Device Package: 0603 (1608 Metric); Height - Seated (Max): 0.022" (0.55mm); LastUpdated: 6.04.2026 19:43:56; Lifecycle Status: Active; Minimum Order: 1; Number of Terminations: 2; Operating Temperature: -55°C ~ 155°C; Package / Case: 0603 (1608 Metric); Packaging: TapeAndReel; PartId: 10303; Part Status: Active; Price: 0.03; Resistance: 23.2 kOhms; Series: RT; Size / Dimension: 0.063" L x 0.031" W (1.60mm x 0.80mm); Supplier 1: DigiKey; Supplier Part Number 1: YAG4507CT-ND; Supplier Device Package: 0603; Tolerance: ±0.1%
R?#7 = RT0603BRD07100KL: RES SMD 100K OHM 0.1% 1/10W 0603; Manufacturer: Yageo; Power (Watts): 0.1W, 1/10W; Temperature Coefficient: ±25ppm/°C; Part Number: RT0603BRD07100KL; Value: 100 kOhms; ComponentLink1Description: Datasheet; ComponentLink1URL: https://www.yageo.com/upload/media/product/productsearch/datasheet/rchip/PYu-RT_1-to-0.01_RoHS_L_11.pdf; ComponentLink2Description: DigiKey Link; ComponentLink2URL: https://www.digikey.com/en/products/detail/yageo/RT0603BRD07100KL/1072187; Composition: Thin Film; Device Package: 0603 (1608 Metric); Height - Seated (Max): 0.022" (0.55mm); LastUpdated: 6.04.2026 19:44:01; Lifecycle Status: Active; Minimum Order: 1; Number of Terminations: 2; Operating Temperature: -55°C ~ 155°C; Package / Case: 0603 (1608 Metric); Packaging: TapeAndReel; PartId: 5628; Part Status: Active; Price: 0.03; Resistance: 100 kOhms; Series: RT; Size / Dimension: 0.063" L x 0.031" W (1.60mm x 0.80mm); Supplier 1: DigiKey; Supplier Part Number 1: YAG1235CT-ND; Supplier Device Package: 0603; Tolerance: ±0.1%
R?#8 = RC0603FR-0716K9L: RES 16.9K OHM 1% 1/10W 0603; Manufacturer: Yageo; Power (Watts): 0.1W, 1/10W; Temperature Coefficient: ±100ppm/°C; Part Number: RC0603FR-0716K9L; Value: 16.9 kOhms; ComponentLink1Description: Datasheet; ComponentLink1URL: https://www.yageo.com/upload/media/product/productsearch/datasheet/rchip/PYu-RC_Group_51_RoHS_L_10.pdf; ComponentLink2Description: DigiKey Link; ComponentLink2URL: https://www.digikey.com/en/products/detail/yageo/RC0603FR-0716K9L/726971; Composition: Thick Film; Device Package: 0603 (1608 Metric); Features: Moisture Resistant; Height - Seated (Max): 0.022" (0.55mm); LastUpdated: 6.04.2026 19:43:54; Lifecycle Status: Active; Minimum Order: 1; Number of Terminations: 2; Operating Temperature: -55°C ~ 155°C; Package / Case: 0603 (1608 Metric); Packaging: CutTape; PartId: 12287; Part Status: Active; Price: 0.01; Resistance: 16.9 kOhms; Series: RC_L; Size / Dimension: 0.063" L x 0.031" W (1.60mm x 0.80mm); Supplier 1: DigiKey; Supplier Part Number 1: 311-16.9KHRCT-ND; Supplier Device Package: 0603; Tolerance: ±1%
R?#9 = RMCF0603JT470R: RES 470 OHM 5% 1/10W 0603; Manufacturer: Stackpole Electronics Inc; Power (Watts): 0.1W, 1/10W; Temperature Coefficient: ±200ppm/°C; Part Number: RMCF0603JT470R; Value: 470 Ohms; ComponentLink1Description: Datasheet; ComponentLink1URL: https://www.seielect.com/catalog/sei-rmcf_rmcp.pdf; ComponentLink2Description: DigiKey Link; ComponentLink2URL: https://www.digikey.com/en/products/detail/stackpole-electronics-inc/RMCF0603JT470R/1757954; Composition: Thick Film; Device Package: 0603 (1608 Metric); Features: Automotive AEC-Q200; Height - Seated (Max): 0.022" (0.55mm); LastUpdated: 9.02.2024 20:43:33; Lifecycle Status: Active; Minimum Order: 1; Number of Terminations: 2; Operating Temperature: -55°C ~ 155°C; Package / Case: 0603 (1608 Metric); Packaging: CutTape; PartId: 5857; Part Status: Active; Price: 0.01; Ratings: AEC-Q200; Resistance: 470 Ohms; Series: RMCF; Size / Dimension: 0.061" L x 0.031" W (1.55mm x 0.80mm); Supplier 1: DigiKey; Supplier Part Number 1: RMCF0603JT470RCT-ND; Supplier Device Package: 0603; Tolerance: ±5%
R?#10-R?#14 = RT0603BRD0749R9L: RES SMD 49.9 OHM 0.1% 1/10W 0603; Manufacturer: Yageo; Power (Watts): 0.1W, 1/10W; Temperature Coefficient: ±25ppm/°C; Part Number: RT0603BRD0749R9L; Value: 49.9 Ohms; ComponentLink1Description: Datasheet; ComponentLink1URL: https://www.yageo.com/upload/media/product/productsearch/datasheet/rchip/PYu-RT_1-to-0.01_RoHS_L_11.pdf; ComponentLink2Description: DigiKey Link; ComponentLink2URL: https://www.digikey.com/en/products/detail/yageo/RT0603BRD0749R9L/1072551; Composition: Thin Film; Device Package: 0603 (1608 Metric); Height - Seated (Max): 0.022" (0.55mm); LastUpdated: 6.04.2026 19:43:55; Lifecycle Status: Active; Minimum Order: 1; Number of Terminations: 2; Operating Temperature: -55°C ~ 155°C; Package / Case: 0603 (1608 Metric); Packaging: TapeAndReel; PartId: 10411; Part Status: Active; Price: 0.03; Resistance: 49.9 Ohms; Series: RT; Size / Dimension: 0.063" L x 0.031" W (1.60mm x 0.80mm); Supplier 1: DigiKey; Supplier Part Number 1: YAG1672CT-ND; Supplier Device Package: 0603; Tolerance: ±0.1%
U?#4 = AP7361EA-33Y5-13: No Description Available; Manufacturer_Name: Diodes Inc; Type: Power Management; Copyright: Copyright (C) 2026 Ultra Librarian. All rights reserved.; Manufacturer_Part_Number: AP7361EA-33Y5-13; Digi-Key_Part_Number_1: 31-AP7361EA-33Y5-13TR-ND; Digi-Key_Part_Number_2: 31-AP7361EA-33Y5-13CT-ND; Digi-Key_Part_Number_3: 31-AP7361EA-33Y5-13DKR-ND; RefDes: RefDes
U?#5 = LMR14020SSQDDARQ1: SIMPLE SWITCHERÂ® Automotive 40-V, 2-A, 2.2-MHz step-down converter with 40-uA IQ 8-SO PowerPAD -40 to 125; Manufacturer_Name: Texas Instruments; PartNumber: LMR14020SQDDARQ1; CompType: IC; TYPE: TYPE; RefDes: RefDes; Copyright: Copyright (C) 2026 Ultra Librarian. All rights reserved.; Manufacturer_Part_Number: LMR14020SSQDDARQ1; Datasheet: https://www.ti.com/lit/gpn/lmr14020-q1; Digi-Key_Part_Number_1: 296-43399-1-ND; Digi-Key_Part_Number_2: 296-43399-2-ND; Digi-Key_Part_Number_3: 296-43399-6-ND; Application_BuildNumber: *; PackageReference: DDA0008E; MountType: SMT; RoHS: Y; Manufacturer: Texas Instruments
U?#6 = USBLC6-2SC6_1: ESD Protection for USB 2.0 High Speed; Manufacturer_Name: STMicroelectronics; Copyright: Copyright (C) 2025 Ultra Librarian. All rights reserved.; Manufacturer_Part_Number: USBLC6-2SC6; RefDes: RefDes; Type: Type
U?#7 U?#8 = LM66100QDCKRQ1: Automotive 1.5-V to 5.5-V, 1.5-A, 0.5-µA IQ ideal diode with integrated FET 6-SC70 -40 to 125; Manufacturer: Texas Instruments; Manufacturer Lifecycle Status: ACTIVE; Number of Channels: 1; Supplier 1: Mouser; RoHS: Compliant; Category: Integrated Circuits (ICs); Stock 1: 6230; Pricing 1: 1=0,44, 10=0,3, 50=0,268, 100=0,231, 1000=0,192, 10000=0,162 (USD); Height: 1.1mm; Length: 2mm; Lifecycle Status: Production; Pins: 6; Thickness: 900µm; Width: 1.25mm; ComponentLink1URL: https://sigma.octopart.com:443/182282881/technical_drawing/Texas-Instruments-LM66100QDCKRQ1.pdf?src-supplier=Texas+Instruments; ComponentLink1Description: https://sigma.octopart.com:443/182282881/technical_drawing/Texas-Instruments-LM66100QDCKRQ1.pdf?src-supplier=Texas+Instruments; ComponentLink2URL: https://octopart.com:443/opatz8j6/c1?t=jdCLViSIeG4YZ9ZuzKCNxeHrtAYQiHtjLnoCJdnTkIENZAXXnoDYtDpVz_daszEZ_omeOgwbrmFBYUi5AkwR7eM8t8iZ72RfnlqvGwU6_jE4yrwgMEwg-2HSYoRDjytZp9KEDB5B7l-qBb_fnzZ_WbvaCPx5IiWZMXl9PVcFNlkcLpwihJYGvxRy4vGQaZq3LCN_wBmFWhmOfA5zAVyTEG5l2uxwd52RgyhD8dKhsgT7_r7ZepCD5zY5saeBipI4fS3N7MZVpLru2ehYOJw6de9vorOe3pZYJsFY7-OBR0BSaU0hfOEKG-rDaEGOFQc-ZQaZyMD6ilOsSvDf3YEp-B7J1W4vq7lfTsucZ8Rly6Y4JHbpczoF_K_FgpkXTM47lS3C0Hxri0uf&src-supplier=Texas+Instruments; ComponentLink2Description: https://octopart.com:443/opatz8j6/c1?t=jdCLViSIeG4YZ9ZuzKCNxeHrtAYQiHtjLnoCJdnTkIENZAXXnoDYtDpVz_daszEZ_omeOgwbrmFBYUi5AkwR7eM8t8iZ72RfnlqvGwU6_jE4yrwgMEwg-2HSYoRDjytZp9KEDB5B7l-qBb_fnzZ_WbvaCPx5IiWZMXl9PVcFNlkcLpwihJYGvxRy4vGQaZq3LCN_wBmFWhmOfA5zAVyTEG5l2uxwd52RgyhD8dKhsgT7_r7ZepCD5zY5saeBipI4fS3N7MZVpLru2ehYOJw6de9vorOe3pZYJsFY7-OBR0BSaU0hfOEKG-rDaEGOFQc-ZQaZyMD6ilOsSvDf3YEp-B7J1W4vq7lfTsucZ8Rly6Y4JHbpczoF_K_FgpkXTM47lS3C0Hxri0uf&src-supplier=Texas+Instruments; ComponentLink3URL: https://sigma.octopart.com:443/178868976/technical_drawing/Texas-Instruments-LM66100QDCKRQ1.pdf?src-supplier=Texas+Instruments; ComponentLink3Description: https://sigma.octopart.com:443/178868976/technical_drawing/Texas-Instruments-LM66100QDCKRQ1.pdf?src-supplier=Texas+Instruments; ComponentLink4URL: https://datasheet.octopart.com:443/LM66100QDCKRQ1-Texas-Instruments-datasheet-164731151.pdf?src-supplier=ODG+(Origin+Data+Global); ComponentLink4Description: https://datasheet.octopart.com:443/LM66100QDCKRQ1-Texas-Instruments-datasheet-164731151.pdf?src-supplier=ODG+(Origin+Data+Global); ComponentLink5URL: http://sigma.octopart.com:80/reach_statement/Texas-Instruments-company-64.pdf?src-supplier=Compliance+Statements; ComponentLink5Description: http://sigma.octopart.com:80/reach_statement/Texas-Instruments-company-64.pdf?src-supplier=Compliance+Statements; ComponentLink6URL: http://sigma.octopart.com:80/conflict_mineral_statement/Texas-Instruments-company-63.pdf?src-supplier=Compliance+Statements; ComponentLink6Description: http://sigma.octopart.com:80/conflict_mineral_statement/Texas-Instruments-company-63.pdf?src-supplier=Compliance+Statements; Supplier Part Number 1: 595-LM66100QDCKRQ1; Manufacturer Part Number: LM66100QDCKRQ1
J?#3 = S4B-XH-A: Package: None; Price: None; Value: *; MP: S4B-XH-A; Availability: Unavailable

## Nets that join several sheets
3V3: Analyzer_MCUSchematic (16 pins), Analyzer_PowerSchematic (5 pins)
5V_CAN1: Analyzer_MCUSchematic (U?#1.11 U?#1.16), Analyzer_PowerSchematic (J?#4.4)
5V_CAN2: Analyzer_MCUSchematic (U?#3.11 U?#3.16), Analyzer_PowerSchematic (J?#6.4)
GND: Analyzer_MCUSchematic (25 pins), Analyzer_PowerSchematic (38 pins)
GND_CAN1: Analyzer_MCUSchematic (7 pins), Analyzer_PowerSchematic (J?#4.3)
GND_CAN2: Analyzer_MCUSchematic (D?#2.3 U?#3.9 U?#3.10 U?#3.15), Analyzer_PowerSchematic (J?#6.3)
VIN_24-12V: Analyzer_MCUSchematic (J?#1.1), Analyzer_PowerSchematic (C?#19.2 C?#20.2 U?#5.2 U?#5.3)
NetU?#2_44: Analyzer_MCUSchematic (U?#2.44), Analyzer_PowerSchematic (U?#6.4)
NetU?#2_45: Analyzer_MCUSchematic (U?#2.45), Analyzer_PowerSchematic (U?#6.6)
NRST: Analyzer_MCUSchematic (U?#2.7), Analyzer_PowerSchematic (C?#31.2 R?#14.2)
SYS_SWCLK: Analyzer_MCUSchematic (U?#2.49), Analyzer_PowerSchematic (R?#13.2)
SYS_SWDIO: Analyzer_MCUSchematic (U?#2.46), Analyzer_PowerSchematic (R?#12.2)
USART3_RX: Analyzer_MCUSchematic (U?#2.30), Analyzer_PowerSchematic (R?#10.2)
USART3_TX: Analyzer_MCUSchematic (U?#2.29), Analyzer_PowerSchematic (R?#11.2)